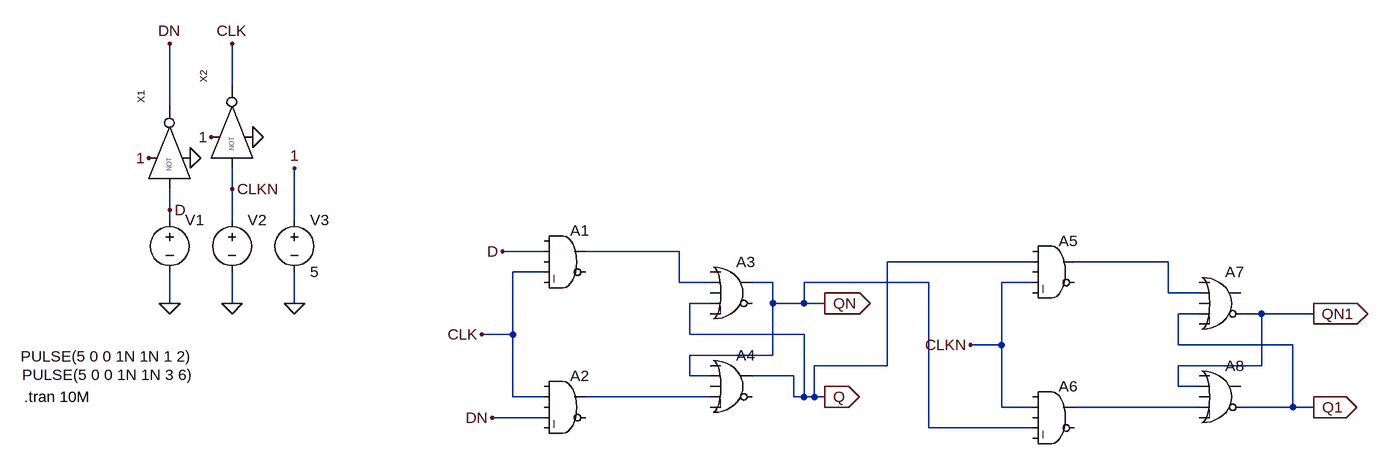
[diagram p0: schematic FAILL.asc]
FAILL.asc, the LTspice schematic file:
Version 4
SHEET 1 1308 680
WIRE -464 -272 -464 -336
WIRE -560 -240 -560 -336
WIRE -464 -112 -464 -144
WIRE -560 -80 -560 -112
WIRE -560 -64 -560 -80
WIRE -464 -64 -464 -112
WIRE -368 -64 -368 -144
WIRE 16 -16 -48 -16
WIRE 224 -16 80 -16
WIRE 768 0 544 0
WIRE 976 0 832 0
WIRE 16 16 -32 16
WIRE 224 32 224 -16
WIRE 272 32 224 32
WIRE 368 32 336 32
WIRE 608 32 416 32
WIRE 768 32 720 32
WIRE 976 48 976 0
WIRE 1024 48 976 48
WIRE -560 64 -560 16
WIRE -464 64 -464 16
WIRE -368 64 -368 16
WIRE 272 64 240 64
WIRE 368 64 368 32
WIRE 416 64 416 32
WIRE 416 64 368 64
WIRE 448 64 416 64
WIRE 1024 80 992 80
WIRE 1120 80 1088 80
WIRE 1200 80 1120 80
WIRE -32 112 -32 16
WIRE -32 112 -80 112
WIRE 240 112 240 64
WIRE 416 112 240 112
WIRE 720 128 720 32
WIRE 720 128 672 128
WIRE 992 128 992 80
WIRE 1168 128 992 128
WIRE 368 144 368 64
WIRE 368 144 240 144
WIRE 544 160 544 0
WIRE 544 160 432 160
WIRE 1120 160 1120 80
WIRE 1120 160 992 160
WIRE 240 176 240 144
WIRE 272 176 240 176
WIRE 400 176 336 176
WIRE 992 192 992 160
WIRE 1024 192 992 192
WIRE -32 208 -32 112
WIRE 16 208 -32 208
WIRE 272 208 80 208
WIRE 400 208 400 176
WIRE 416 208 416 112
WIRE 416 208 400 208
WIRE 432 208 432 160
WIRE 432 208 416 208
WIRE 448 208 432 208
WIRE 720 224 720 128
WIRE 768 224 720 224
WIRE 1024 224 832 224
WIRE 1168 224 1168 128
WIRE 1168 224 1088 224
WIRE 1200 224 1168 224
WIRE 16 240 -64 240
WIRE 608 256 608 32
WIRE 768 256 608 256
FLAG -560 64 0
FLAG -464 64 0
FLAG -528 -160 0
FLAG -368 -144 1
FLAG -592 -160 1
FLAG -560 -336 DN
FLAG -560 -80 D
FLAG -464 -336 CLK
FLAG -80 112 CLK
FLAG -48 -16 D
FLAG -64 240 DN
FLAG 448 64 QN
IOPIN 448 64 Out
FLAG 448 208 Q
IOPIN 448 208 Out
FLAG -368 64 0
FLAG -496 -192 1
FLAG -432 -192 0
FLAG 672 128 CLKN
FLAG 1200 80 QN1
IOPIN 1200 80 Out
FLAG 1200 224 Q1
IOPIN 1200 224 Out
FLAG -464 -112 CLKN
SYMBOL Digital\\and 48 -64 R0
SYMATTR InstName A1
SYMBOL Digital\\and 48 160 R0
SYMATTR InstName A2
SYMBOL Digital\\or 304 -16 R0
SYMATTR InstName A3
SYMBOL Digital\\or 304 128 R0
SYMATTR InstName A4
SYMBOL voltage -560 -80 R0
WINDOW 3 -229 226 Left 2
WINDOW 123 0 0 Left 0
WINDOW 39 0 0 Left 0
SYMATTR Value PULSE(5 0 0 1N 1N 1 2)
SYMATTR InstName V1
SYMBOL voltage -464 -80 R0
WINDOW 3 -323 254 Left 2
WINDOW 123 0 0 Left 0
WINDOW 39 0 0 Left 0
SYMATTR Value PULSE(5 0 0 1N 1N 3 6)
SYMATTR InstName V2
SYMBOL NOT4 -544 -176 R270
SYMATTR InstName X1
SYMBOL voltage -368 -80 R0
WINDOW 123 0 0 Left 0
WINDOW 39 0 0 Left 0
SYMATTR InstName V3
SYMATTR Value 5
SYMBOL NOT4 -448 -208 R270
SYMATTR InstName X2
SYMBOL Digital\\and 800 -48 R0
SYMATTR InstName A5
SYMBOL Digital\\and 800 176 R0
SYMATTR InstName A6
SYMBOL Digital\\or 1056 0 R0
SYMATTR InstName A7
SYMBOL Digital\\or 1056 144 R0
SYMATTR InstName A8
TEXT -784 208 Left 2 !.tran 10M

The netlist it stands for:
* FAILL.asc
A1 0 D 0 CLK 0 0 N001 0 AND
A2 0 CLK 0 DN 0 0 N003 0 AND
A3 0 N001 0 Q 0 0 QN 0 OR
A4 0 QN 0 N003 0 0 Q 0 OR
V1 D 0 PULSE(5 0 0 1N 1N 1 2)
V2 CLKN 0 PULSE(5 0 0 1N 1N 3 6)
XX1 D 1 0 DN NOT4  ; pins A VH VL OUT
V3 1 0 5
XX2 CLKN 1 0 CLK NOT4  ; pins A VH VL OUT
A5 0 Q 0 CLKN 0 0 N002 0 AND
A6 0 CLKN 0 QN 0 0 N004 0 AND
A7 0 N002 0 Q1 0 QN1 0 0 OR
A8 0 QN1 0 N004 0 Q1 0 0 OR
.tran 10M
.backanno
.end